# Altium schematic sheet PAGE1.schdoc: Active Tag 916 Transmitter/Processor
size B; DocumentNumber: Credit Card Size Tag; Revision: 37; SheetNumber: 1; SheetTotal: 2
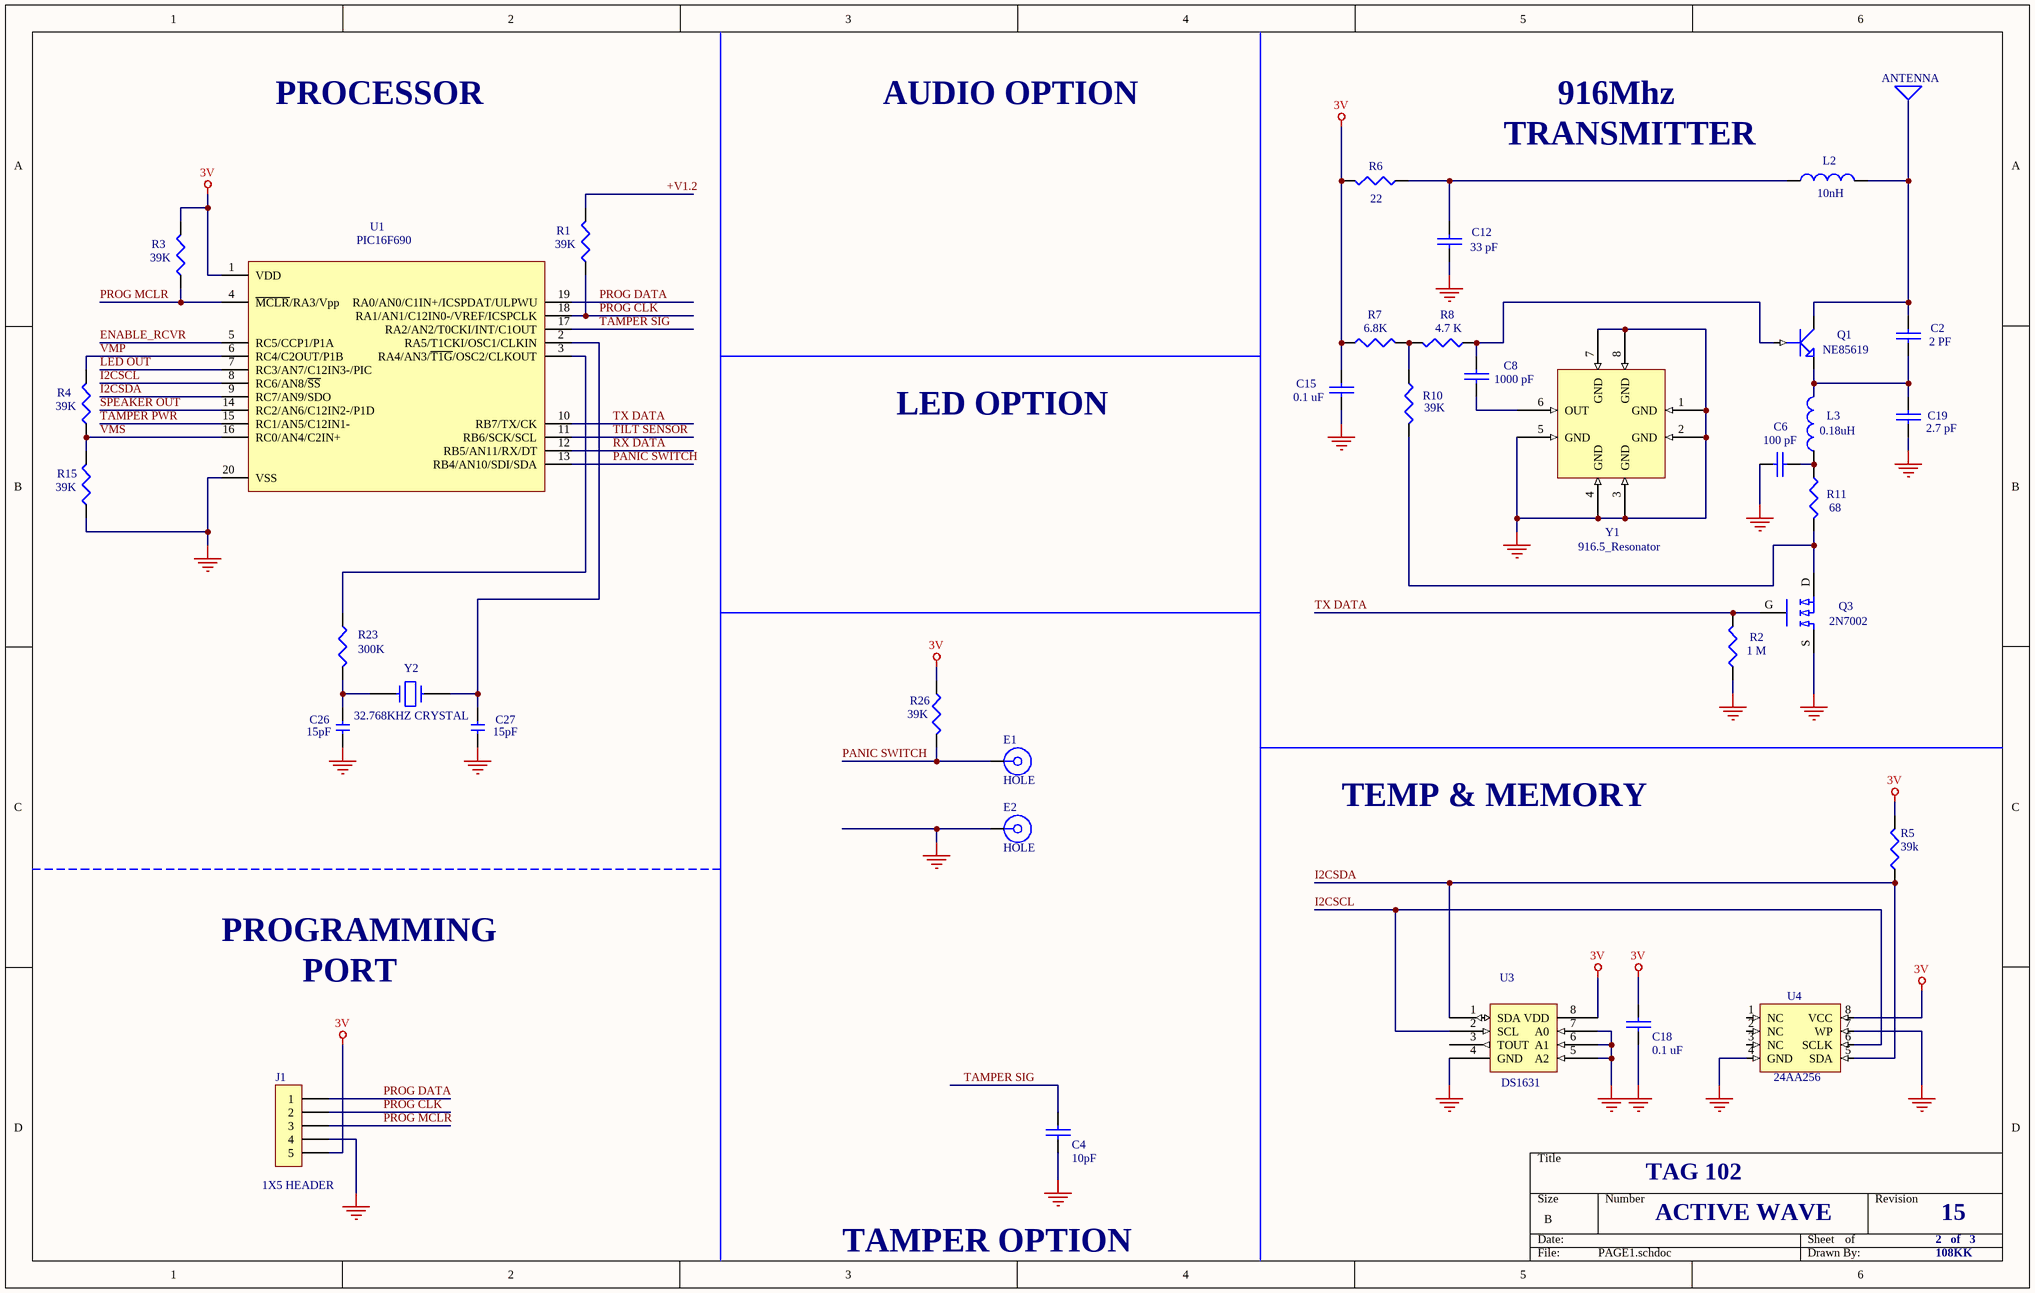
[diagram p0: PAGE1.schdoc]

## Parts
C2  2 PF  [0603]
C4  10pF  [0603]
C6  100 pF  [0603]
C8  1000 pF  [0603]
C12  33 pF  [0603]
C15  0.1 uF  [0603]
C18  0.1 uF  [0603]
C19  2.7 pF  [0603]
C26  15pF  [0603]
C27  15pF  [0603]
E1  HOLE  [EH_D0500P1000]
E2  HOLE  [EH_D0500P1000]
J1  1X5 HEADER  [CONN5]
L2  10nH  [0603]
L3  0.18uH  [0603]
Q1  NE85619  [3 PIN ULTRA SUPER MINI MOLD]
Q3  2N7002
R1  39K  [0603]
R2  1 M  [0603]
R3  39K  [0603]
R4  39K  [0603]
R5  39k  [0603]
R6  22  [0603]
R7  6.8K  [0603]
R8  4.7 K  [0603]
R10  39K  [0603]
R11  68  [0603]
R15  39K  [0603]
R23  300K  [0603]
R26  39K  [0603]
U1  PIC16F690
U3  DS1631  [SO8 SMALL]
U4  24AA256  [SO8]
Y1  916.5_Resonator  [RESONATOR]
Y2  32.768KHZ CRYSTAL  [CRYSTAL ABRACON ABS07]

## Nets
3V: C15.1 C18.1 J1.5 R3.2 R5.2 R6.2 R7.1 R26.1 U1.1(VDD) U3.8(VDD) U4.8(VCC)
GND: C4.2 C6.1 C12.2 C15.2 C18.2 C19.2 C26.1 C27.1 E2.1 J1.4 Q3.S R2.1 R15.1 U1.20(VSS) U3.4(GND) U3.5(A2) U3.6(A1) U3.7(A0) U4.4(GND) U4.7(WP) Y1.1(GND) Y1.2(GND) Y1.3(GND) Y1.4(GND) Y1.5(GND) Y1.7(GND) Y1.8(GND)
+V1.2: R1.2
ENABLE_RCVR: U1.5(RC5/CCP1/P1A)
I2CSCL: U1.8(RC6/AN8/~{SS}) U3.2(SCL) U4.6(SCLK)
I2CSDA: R5.1 U1.9(RC7/AN9/SDO) U3.1(SDA) U4.5(SDA)
LED OUT: U1.7(RC3/AN7/C12IN3-/PIC)
PANIC SWITCH: E1.1 R26.2 U1.13(RB4/AN10/SDI/SDA)
PROG CLK: J1.2 R1.1 U1.18(RA1/AN1/C12IN0-/VREF/ICSPCLK)
PROG DATA: J1.1 U1.19(RA0/AN0/C1IN+/ICSPDAT/ULPWU)
PROG MCLR: J1.3 R3.1 U1.4(~{MCLR}/RA3/Vpp)
RX DATA: U1.12(RB5/AN11/RX/DT)
SPEAKER OUT: U1.14(RC2/AN6/C12IN2-/P1D)
TAMPER PWR: U1.15(RC1/AN5/C12IN1-)
TAMPER SIG: C4.1 U1.17(RA2/AN2/T0CKI/INT/C1OUT)
TILT SENSOR: U1.11(RB6/SCK/SCL)
TX DATA: Q3.G R2.2 U1.10(RB7/TX/CK)
VMP: R4.2 U1.6(RC4/C2OUT/P1B)
VMS: R4.1 R15.2 U1.16(RC0/AN4/C2IN+)
NetC2_1: C2.1 L2.2 Q1.C
NetC2_2: C2.2 C19.1 L3.2 Q1.E
NetC6_2: C6.2 L3.1 R11.1
NetC8_1: C8.1 Q1.B R8.1
NetC8_2: C8.2 Y1.6(OUT)
NetC12_1: C12.1 L2.1 R6.1
NetC26_2: C26.2 R23.2 Y2.2
NetC27_2: C27.2 U1.2(RA5/T1CKI/OSC1/CLKIN) Y2.1
NetQ3_D: Q3.D R10.2 R11.2
NetR7_2: R7.2 R8.2 R10.1
NetR23_1: R23.1 U1.3(RA4/AN3/~{T1G}/OSC2/CLKOUT)

Not connected (* = marked no-connect by the designer): U3 3(TOUT); U4 1(NC) 2(NC) 3(NC)

## Notes on the sheet
- ANTENNA
- PROCESSOR
- AUDIO OPTION
- TRANSMITTER
- 916Mhz
- LED OPTION
- TEMP & MEMORY
- PROGRAMMING
- PORT
- TAG 102
- ACTIVE WAVE
- 2   of   3
- 15
- TAMPER OPTION
- 108KK

## Library data of the parts
C2 C4 C6 C8 C12 C15 C18 C19 = CAP: Capacitor
C26 C27 = C: Text Field1: 10; Text Field2: 20
E1 E2 = 0.50DRL-P: Mfr: 0; Description: DRL 0.50,PAD 1.00-P; COMPHEIGHT: 0.000; SEC_PT_NBR: P_D0500P1000; PC: UNDEFINED; FP_SQ_AREA: 2.50; AUTO_INSERTABLE: N; FOLDER_TYPE: DISCRETES\MISC; PART_VALUE: 0.50DRL-P; Mfr Part Number: 0; PR_COST: 0; PR_STOCK: 0; IR_COST: 0; IR_STOCK: 0
J1 = CON5: Connector
L2 L3 = INDUCTOR: Text Field1: 20; Text Field2: 40
Q1 = NPN1: NPN Transistor
Q3 = FET 2
R1-R8 R10 R15 R23 R26 = RESISTOR: Text Field1: 20; Text Field2: 30
R11 = RES1
U3 = DS1631: Text Field1: 50; Text Field2: 50
Y1 = RESONATOR
Y2 = CRYSTAL